# Altium schematic sheet OUTPUT_RELAY.SchDoc
size A4; SheetNumber: 3; SheetTotal: 5
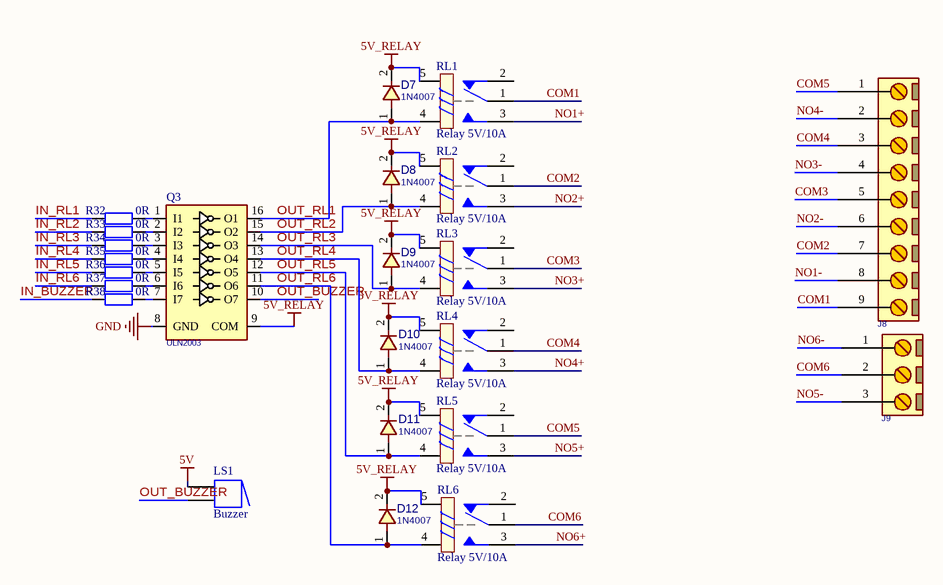
[diagram p0: OUTPUT_RELAY.SchDoc]

## Parts
D7  1N4007  [D_SMA]
D8  1N4007  [D_SMA]
D9  1N4007  [D_SMA]
D10  1N4007  [D_SMA]
D11  1N4007  [D_SMA]
D12  1N4007  [D_SMA]
J8  CONN_TB9  [TBB_9]  (value not drawn)
J9  CONN_TB3  [TBB_3]  (value not drawn)
LS1  Buzzer  [Buzzer]
Q3  value ULN2003  [SO_16_W]  (hidden comment: ULN2003_SOP16)
R32  Ma_Hang: 0R  [tro smd 0603]  (hidden comment: 0R_0603_1%)
R33  Ma_Hang: 0R  [tro smd 0603]  (hidden comment: 0R_0603_1%)
R34  Ma_Hang: 0R  [tro smd 0603]  (hidden comment: 0R_0603_1%)
R35  Ma_Hang: 0R  [tro smd 0603]  (hidden comment: 0R_0603_1%)
R36  Ma_Hang: 0R  [tro smd 0603]  (hidden comment: 0R_0603_1%)
R37  Ma_Hang: 0R  [tro smd 0603]  (hidden comment: 0R_0603_1%)
R38  Ma_Hang: 0R  [tro smd 0603]  (hidden comment: 0R_0603_1%)
RL1  Relay 5V/10A  [RL_10A_5V]
RL2  Relay 5V/10A  [RL_10A_5V]
RL3  Relay 5V/10A  [RL_10A_5V]
RL4  Relay 5V/10A  [RL_10A_5V]
RL5  Relay 5V/10A  [RL_10A_5V]
RL6  Relay 5V/10A  [RL_10A_5V]

## Nets
5V: LS1.1
5V_RELAY: D7.2 D8.2 D9.2 D10.2 D11.2 D12.2 Q3.9(COM) RL1.5 RL2.5 RL3.5 RL4.5 RL5.5 RL6.5
GND: Q3.8(GND)
COM1: J8.9 RL1.1
COM2: J8.7 RL2.1
COM3: J8.5 RL3.1
COM4: J8.3 RL4.1
COM5: J8.1 RL5.1
COM6: J9.2 RL6.1
IN_BUZZER: R38.2
IN_RL1: R32.2
IN_RL2: R33.2
IN_RL3: R34.2
IN_RL4: R35.2
IN_RL5: R36.2
IN_RL6: R37.2
NO1+: RL1.3
NO1-: J8.8
NO2+: RL2.3
NO2-: J8.6
NO3+: RL3.3
NO3-: J8.4
NO4+: RL4.3
NO4-: J8.2
NO5+: RL5.3
NO5-: J9.3
NO6+: RL6.3
NO6-: J9.1
OUT_BUZZER: LS1.2 Q3.10(O7)
OUT_RL1: D7.1 Q3.16(O1) RL1.4
OUT_RL2: D8.1 Q3.15(O2) RL2.4
OUT_RL3: D9.1 Q3.14(O3) RL3.4
OUT_RL4: D10.1 Q3.13(O4) RL4.4
OUT_RL5: D11.1 Q3.12(O5) RL5.4
OUT_RL6: D12.1 Q3.11(O6) RL6.4
NetQ3_1: Q3.1(I1) R32.1
NetQ3_2: Q3.2(I2) R33.1
NetQ3_3: Q3.3(I3) R34.1
NetQ3_4: Q3.4(I4) R35.1
NetQ3_5: Q3.5(I5) R36.1
NetQ3_6: Q3.6(I6) R37.1
NetQ3_7: Q3.7(I7) R38.1

Not connected (* = marked no-connect by the designer): RL1 2; RL2 2; RL3 2; RL4 2; RL5 2; RL6 2

## Library data of the parts
D7-D12 = DIODE_SMD_1N4007: DIODE, GENERAL PURPOSE, 1000V/1A; MANF: Kingtronics; DESC: DESCRIPTION; PARAM: 1000V VRRM; PARAM2: 1A; MANF_P#: M7; ASSEMBLY: ASSEMBLY; PRICE: PRICE; VALUE: 1N4007
J8 = CONN_TB9: CONN, TERMINAL BLOCK, 5.08mm pitch; VALUE: CONN_TB9
J9 = CONN_TB3: CONN, TERMINAL BLOCK, 5.08mm pitch; VALUE: CONN_TB3
LS1 = Buzzer: Magnetic Transducer Buzzer; Published: 24-Mar-1999; LatestRevisionDate: 17-Dec-2003; LatestRevisionNote: Schematic revised, PCB Footprint replaced.; DatasheetDocument: 17-Dec-2003; PackageReference: ABSM-1574; Publisher: Altium Limited; ComponentLink1Description: Manufacturer Link; ComponentLink1URL: http://www.megastar.com/linecard/buzzmode/index.php
Q3 = ULN2003_SOP16: Darlington, 7-CH, 50V, 0.5A; MANF_P#: ULN2003A; MANF: DIODES; PARAM: 7-CH, 50V, 0.5A; PARAM2: -
R32-R38 = Tro 0603 5% 10k: RES SMD 0603; Chung_Loai: Dán; Don_Vi: Con; So_Chan: 2; Ten_Linh_Kien: Trở 0603 5% 10k; Kieu_Chan: *
RL1-RL6 = Relay 5V10A: Relay SPDT,10A - 12VDC 5 Pin; Value: Relay SPDT, 10A, 12V